# EAGLE design board (EAGLE 9.4.2)

## Sheet 1 of 8

## Sheet 2 of 8
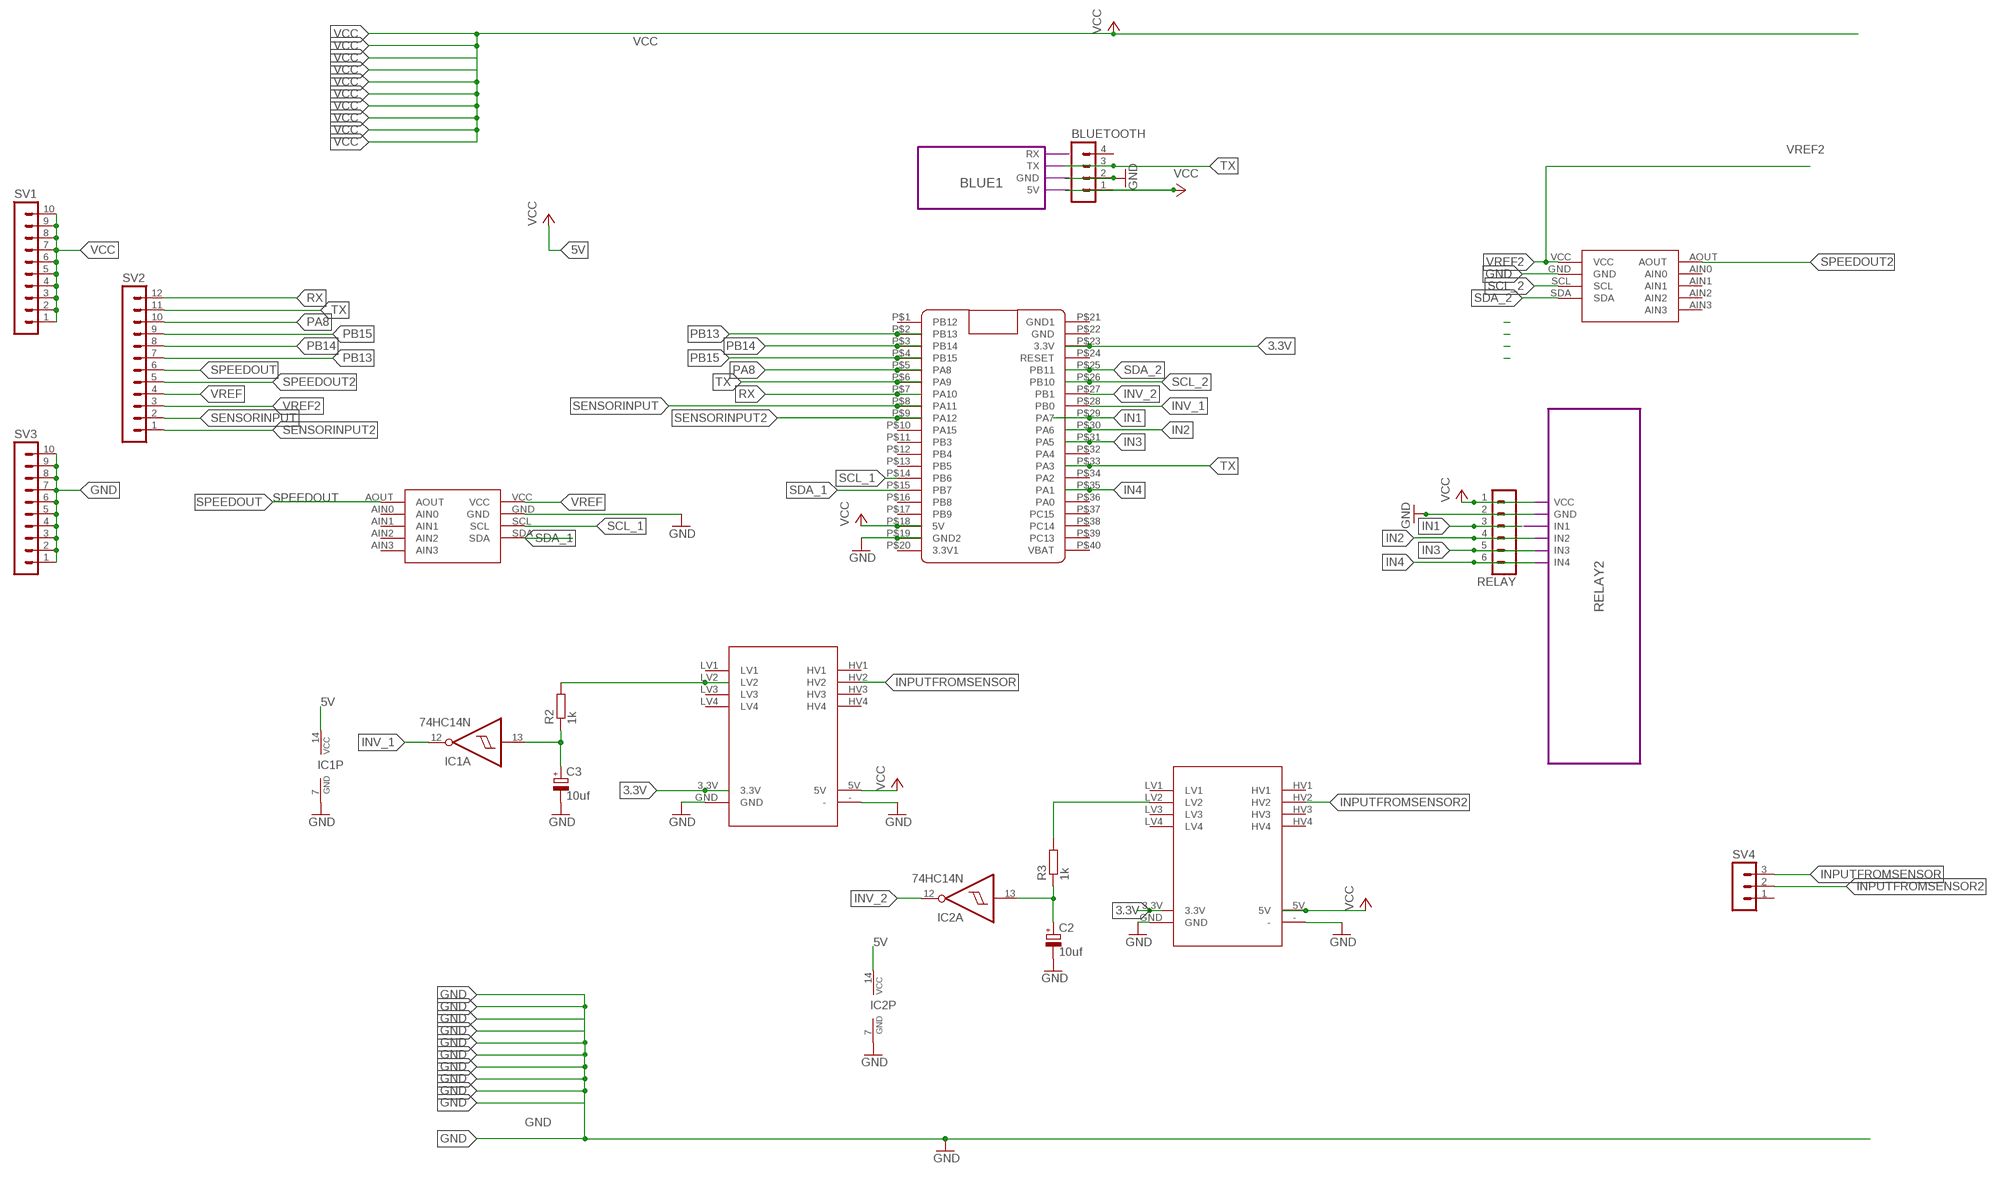
[diagram p0: schematic, sheet 2]

### Parts
BLUETOOTH  MA04-1  [MA04-1]
C2  10uf  CPOL-EUE3.5-8  [E3,5-8]
C3  10uf  CPOL-EUE3.5-8  [E3,5-8]
IC1  74HC14N  [DIL14]
IC2  74HC14N  [DIL14]
R2  1k  R-EU_0207/12  [0207/12]
R3  1k  R-EU_0207/12  [0207/12]
RELAY  MA06-1  [MA06-1]
SV1  MA10-1  [MA10-1]
SV2  MA12-1  [MA12-1]
SV3  MA10-1  [MA10-1]
SV4  MA03-1  [MA03-1]
U$1  SHIFT  [SHIFT]
U$2  SHIFT  [SHIFT]
U$3  BLUE_PILL  [BLUE_PILL]
U$5  DAC  [DAC]
U$6  DAC  [DAC]

### Module instances
RELAY2 = RELAY
BLUE1 = BLUE

### Nets
3.3V: U$1.3.3V U$2.3.3V U$3.P$23(3.3V)
5V: IC1.14(P:VCC) IC2.14(P:VCC) ; supply symbol labelled VCC
GND: BLUETOOTH.2 C2.- C3.- IC1.7(P:GND) IC2.7(P:GND) RELAY.2 SV3.1 SV3.2 SV3.3 SV3.4 SV3.5 SV3.6 SV3.7 SV3.8 SV3.9 SV3.10 U$1.- U$1.GND U$2.- U$2.GND U$3.P$19(GND2) U$5.GND U$6.GND
IN1: RELAY.3 U$3.P$29(PA7)
IN2: RELAY.4 U$3.P$30(PA6)
IN3: RELAY.5 U$3.P$31(PA5)
IN4: RELAY.6 U$3.P$35(PA1)
INPUTFROMSENSOR: SV4.3 U$2.HV2
INPUTFROMSENSOR2: SV4.2 U$1.HV2
INV_1: IC1.12(A:O) U$3.P$28(PB0)
INV_2: IC2.12(A:O) U$3.P$27(PB1)
N$5: R3.2 U$1.LV2
N$10: R2.2 U$2.LV2
N$14: C3.+ IC1.13(A:I) R2.1
N$21: C2.+ IC2.13(A:I) R3.1
PA8: SV2.10 U$3.P$5(PA8)
PB13: SV2.7 U$3.P$2(PB13)
PB14: SV2.8 U$3.P$3(PB14)
PB15: SV2.9 U$3.P$4(PB15)
RX: SV2.12 U$3.P$7(PA10)
SCL_1: U$3.P$14(PB6) U$5.SCL
SCL_2: U$3.P$26(PB10) U$6.SCL
SDA_1: U$3.P$15(PB7) U$5.SDA
SDA_2: U$3.P$25(PB11) U$6.SDA
SENSORINPUT: SV2.2 U$3.P$8(PA11)
SENSORINPUT2: SV2.1 U$3.P$9(PA12)
SPEEDOUT: SV2.6 U$5.AOUT
SPEEDOUT2: SV2.5 U$6.AOUT
TX: BLUETOOTH.3 SV2.11 U$3.P$6(PA9) U$3.P$33(PA3)
VCC: BLUETOOTH.1 RELAY.1 SV1.1 SV1.2 SV1.3 SV1.4 SV1.5 SV1.6 SV1.7 SV1.8 SV1.9 SV1.10 U$1.5V U$2.5V U$3.P$18(5V)
VREF: SV2.4 U$5.VCC
VREF2: SV2.3 U$6.VCC
Unconnected: BLUETOOTH.4 IC1.1(D:I) IC1.2(D:O) IC1.3(E:I) IC1.4(E:O) IC1.5(F:I) IC1.6(F:O) IC1.8(C:O) IC1.9(C:I) IC1.10(B:O) IC1.11(B:I) IC2.1(D:I) IC2.2(D:O) IC2.3(E:I) IC2.4(E:O) IC2.5(F:I) IC2.6(F:O) IC2.8(C:O) IC2.9(C:I) IC2.10(B:O) IC2.11(B:I) SV4.1 U$1.HV1 U$1.HV3 U$1.HV4 U$1.LV1 U$1.LV3 U$1.LV4 U$2.HV1 U$2.HV3 U$2.HV4 U$2.LV1 U$2.LV3 U$2.LV4 U$3.P$1(PB12) U$3.P$10(PA15) U$3.P$11(PB3) U$3.P$12(PB4) U$3.P$13(PB5) U$3.P$16(PB8) U$3.P$17(PB9) U$3.P$20(3.3V1) U$3.P$22(GND) U$3.P$24(RESET) U$3.P$32(PA4) U$3.P$34(PA2) U$3.P$36(PA0) U$3.P$37(PC15) U$3.P$38(PC14) U$3.P$39(PC13) U$3.P$40(VBAT) U$5.AIN0 U$5.AIN1 U$5.AIN2 U$5.AIN3 U$6.AIN0 U$6.AIN1 U$6.AIN2 U$6.AIN3

## Sheet 3 of 8

## Sheet 4 of 8

## Sheet 5 of 8
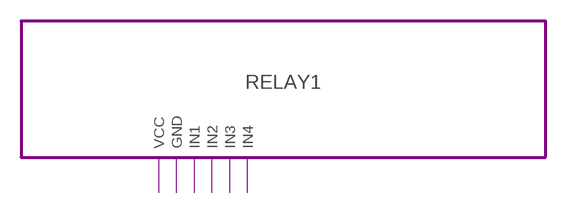
[diagram p1: schematic, sheet 5]

### Module instances
RELAY1 = RELAY

## Sheet 6 of 8
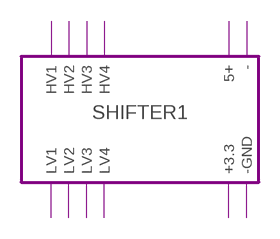
[diagram p2: schematic, sheet 6]

### Module instances
SHIFTER1 = SHIFTER

## Sheet 7 of 8
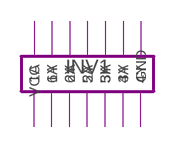
[diagram p3: schematic, sheet 7]

### Module instances
INV1 = INV

## Sheet 8 of 8
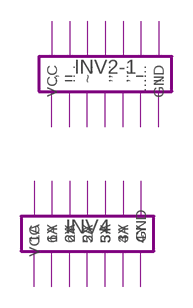
[diagram p4: schematic, sheet 8]

### Module instances
INV4 = INV
INV2-1 = INV2

## Power pins joined to a net without a drawn wire
GND1: U$3.P$21(GND1)

## Library data of the parts
BLUETOOTH = con-lstb:MA04-1: PIN HEADER; OC_FARNELL: unknown; OC_NEWARK: unknown
C2 C3 = rcl:CPOL-EU: POLARIZED CAPACITOR, European symbol; SPICEPREFIX: C
IC1 IC2 = 74xx-eu:74*14: Hex schmitt trigger INVERTER
R2 R3 = rcl:R-EU_: RESISTOR, European symbol; SPICEPREFIX: R
RELAY = con-lstb:MA06-1: PIN HEADER; OC_FARNELL: unknown; OC_NEWARK: unknown
SV1 SV3 = con-lstb:MA10-1: PIN HEADER; OC_FARNELL: unknown; OC_NEWARK: unknown
SV2 = con-lstb:MA12-1: PIN HEADER; OC_FARNELL: unknown; OC_NEWARK: unknown
SV4 = con-lstb:MA03-1: PIN HEADER; OC_FARNELL: unknown; OC_NEWARK: unknown
U$1 U$2 = shift:SHIFT
U$3 = BluePill:BLUE_PILL
U$5 U$6 = dac:DAC

## Module STM
Ports: PB12(io) PB13(io) PB14(io) PB15(io) PA8(io) PA9(io) PA10(io) PA11(io) PA12(io) PA15(io) PB(io) PB4(io) PB5(io) PB6(io) PB7(io) PB88(io) PB9(io) 5V(io) GND(io) VCC3.3(io) G(io) G2(io) 3.3V(io) R(io) B11(io) B10(io) B1(io) B0(io) A7(io) A6(io) A5(io) A4(io) A3(io) A2(io) A1(io) A0(io) C15(io) C14(io) C13(io) VB(io)

### Library data of the parts

## Module DAC
Ports: VCC(io) GND(io) SCL(io) SDA(io) AOUT(io) AINO(io) AIN1(io) AIN2(io) AIN(io)

### Library data of the parts

## Module BLUETOOTH
Ports: RXD(io) TXD(io) GND(io) VCC(io)

### Library data of the parts

## Module RELAY
Ports: VCC(io) GND(io) IN1(io) IN2(io) IN3(io) IN4(io)

### Library data of the parts

## Module SHIFTER
Ports: HV1(io) HV2(io) HV3(io) HV4(io) LV1(io) LV2(io) LV3(io) LV4(io) -(io) 5+(io) +3.3(io) -GND(io)

### Library data of the parts

## Module INV
Ports: VCC(io) 6A(io) 6Y(io) 5A(io) 5Y(io) 4A(io) 4Y(io) 1A(io) 1Y(io) 2A(io) 2Y(io) 3A(io) 3Y(io) GND(io)

### Library data of the parts

## Module INV2
Ports: VCC(io) .(io) ..(io) ...(io) ....(io) ......(io) GND(io) !(io) .!(io) ,(io) ,,(io) ~(io) !!(io) .,(io)

### Library data of the parts

## Module BLUE
Ports: 5V(io) GND(io) TX(io) RX(io)

### Library data of the parts

## Board
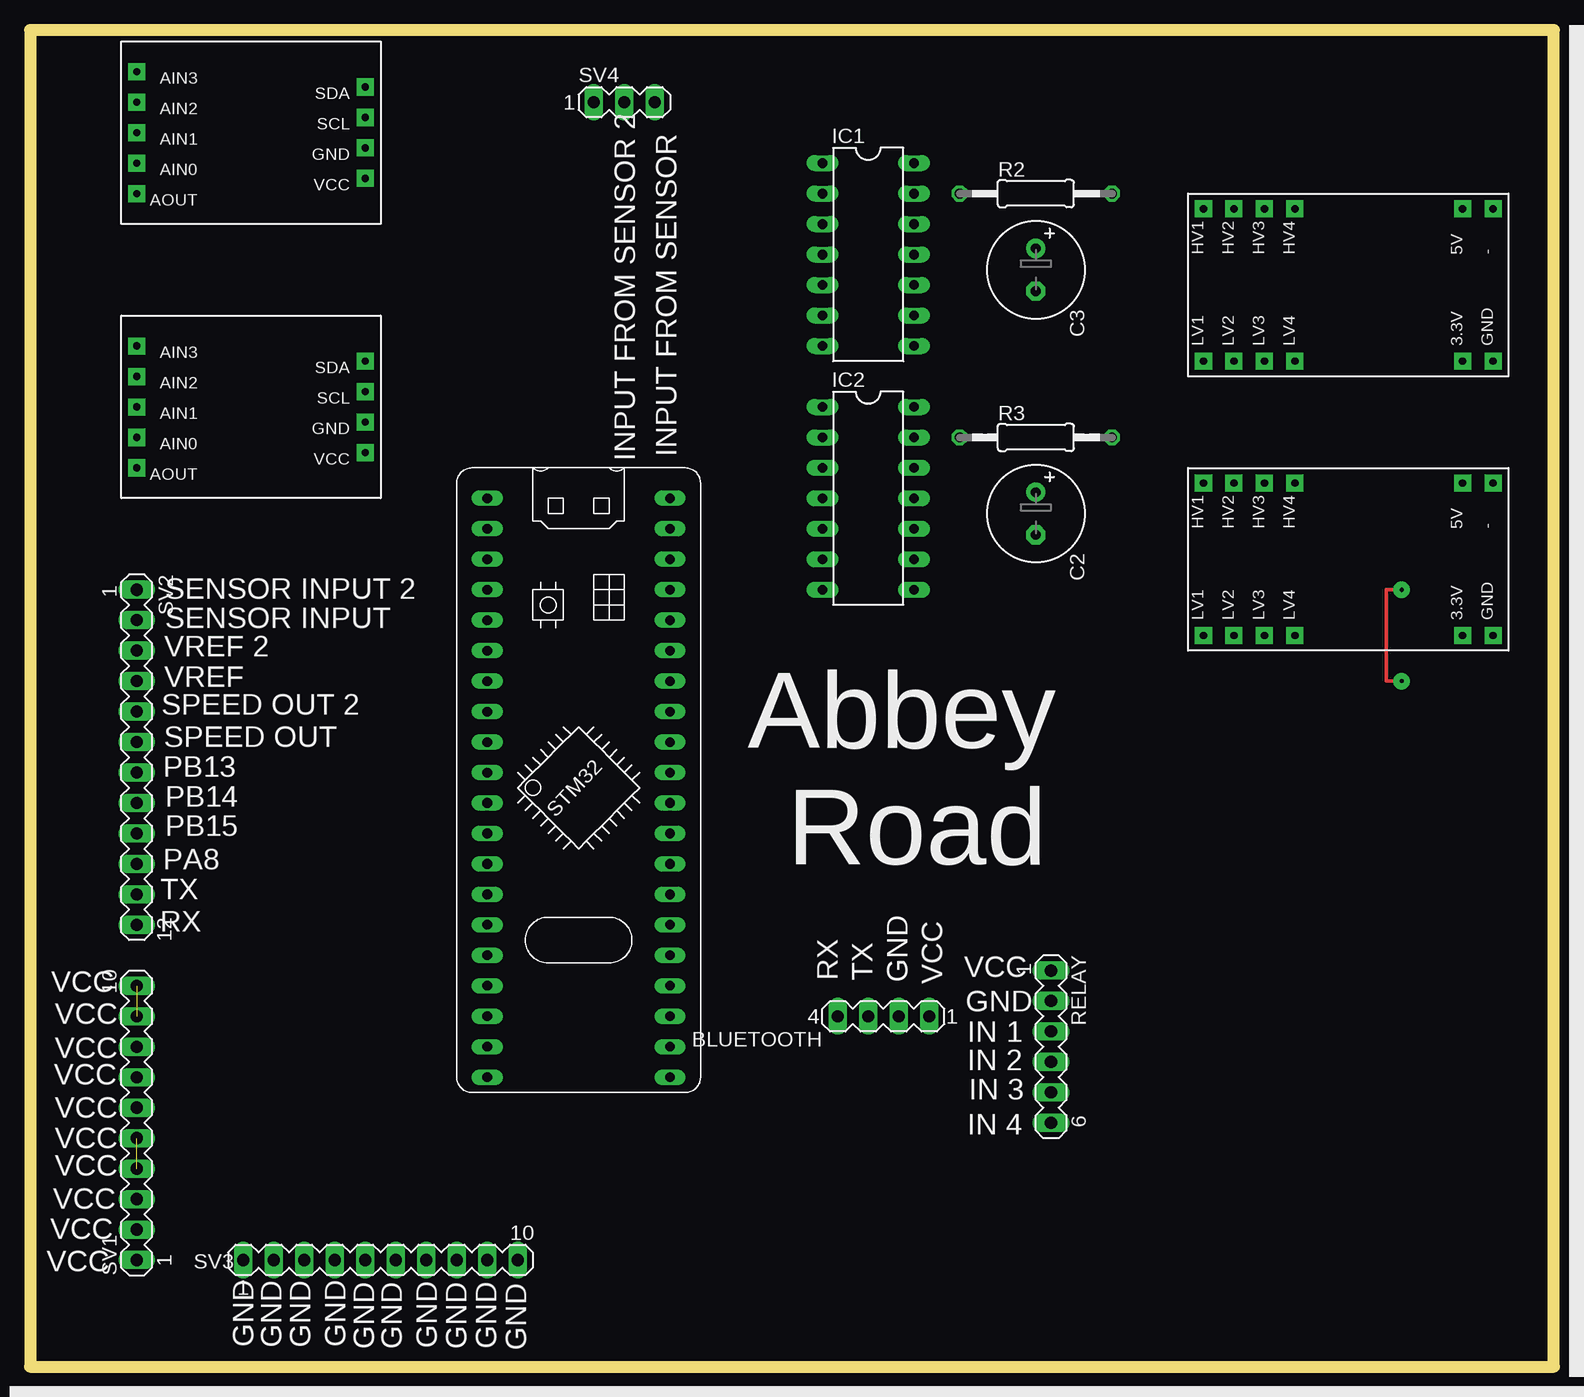
[diagram p5: board, top side]
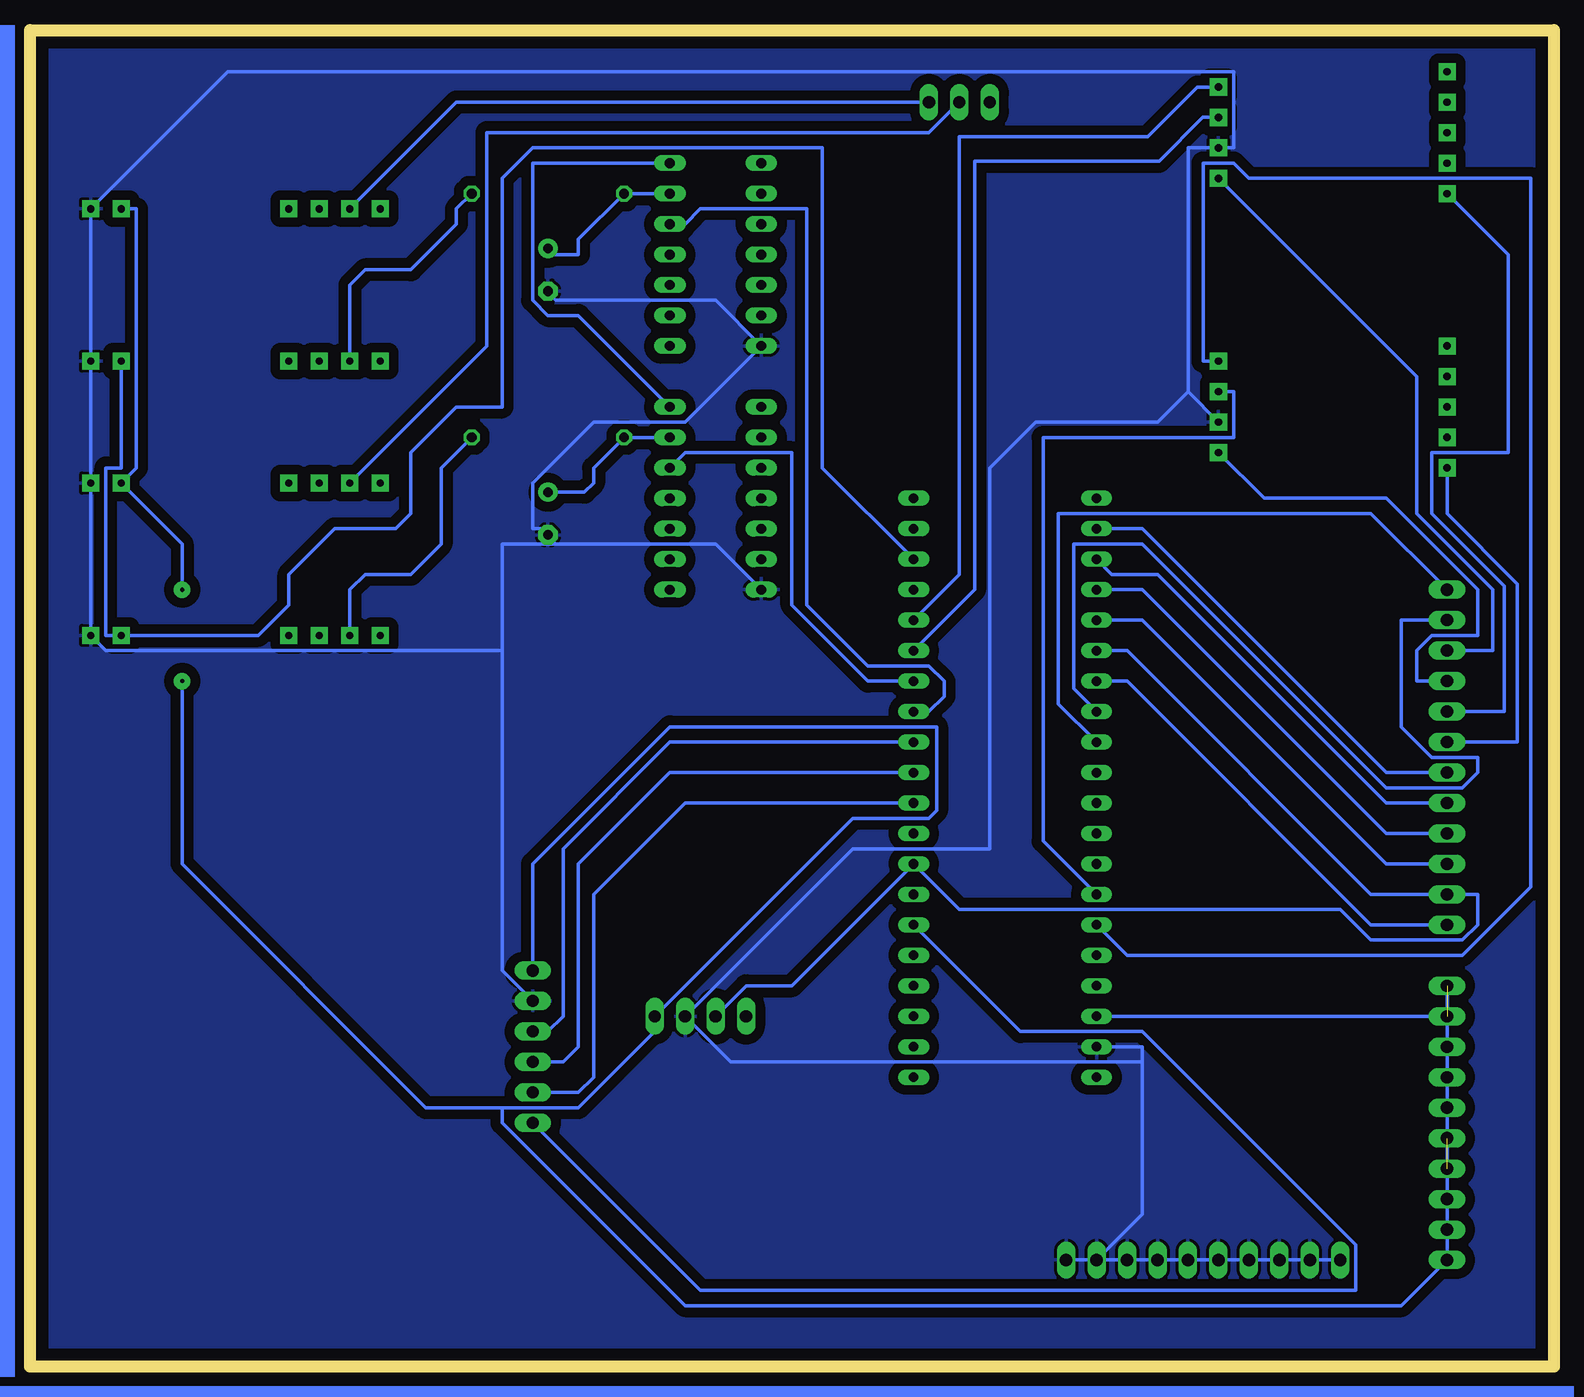
[diagram p6: board, bottom side, seen from below]

Size 126.98 x 111.43 mm. Coordinates in mm from the lower left corner, seen from the top.
Outline: 0,0 126.98,0 126.98,111.43 0,111.43 0,0
Copper layers (1*16): Top 0.035mm / dielectric 1.5mm / Bottom 0.035mm
Design rules "default *": minimum track width 12mil, minimum drill 0.35mm, track to track 18mil, track to pad 12mil, pad to pad 12mil, via to via 12mil, smd to smd 6mil, copper to edge 40mil, drill to drill 6mil, minimum pad ring 10mil, minimum via ring 20mil, stop-mask expansion 4mil, vias tented up to drill 0mil, thermal gap 10mil

### Footprints (pad centres in the part's own frame; a part is rotated, then mirrored left to right if it is on the bottom)
MA04-1 = drill 1.016 long: 1 -3.81,0; 2 -1.27,0; 3 1.27,0; 4 3.81,0
E3,5-8 = drill 0.813 pad 1.6: + -1.778,0 | drill 0.813 pad 1.6 octagon: - 1.778,0
DIL14 = drill 0.813 long: 1 -7.62,-3.81; 2 -5.08,-3.81; 3 -2.54,-3.81; 4 0,-3.81; 5 2.54,-3.81; 6 5.08,-3.81; 7 7.62,-3.81; 8 7.62,3.81; 9 5.08,3.81; 10 2.54,3.81; 11 0,3.81; 12 -2.54,3.81; 13 -5.08,3.81; 14 -7.62,3.81
0207/12 = drill 0.813 octagon: 1 -6.35,0; 2 6.35,0
MA06-1 = drill 1.016 long: 1 -6.35,0; 2 -3.81,0; 3 -1.27,0; 4 1.27,0; 5 3.81,0; 6 6.35,0
MA10-1 = drill 1.016 long: 1 -11.43,0; 2 -8.89,0; 3 -6.35,0; 4 -3.81,0; 5 -1.27,0; 6 1.27,0; 7 3.81,0; 8 6.35,0; 9 8.89,0; 10 11.43,0
MA12-1 = drill 1.016 long: 1 -13.97,0; 2 -11.43,0; 3 -8.89,0; 4 -6.35,0; 5 -3.81,0; 6 -1.27,0; 7 1.27,0; 8 3.81,0; 9 6.35,0; 10 8.89,0; 11 11.43,0; 12 13.97,0
MA03-1 = drill 1.016 long: 1 -2.54,0; 2 0,0; 3 2.54,0
SHIFT = drill 0.6 pad 1.422 square: 3.3V -7.62,-8.89; 5V 5.08,-8.89; - 5.08,-11.43; GND -7.62,-11.43; HV1 5.08,12.7; HV2 5.08,10.16; HV3 5.08,7.62; HV4 5.08,5.08; LV1 -7.62,12.7; LV2 -7.62,10.16; LV3 -7.62,7.62; LV4 -7.62,5.08
BLUE_PILL = drill 0.8 long: P$1 -7.62,15.24; P$2 -7.62,12.7; P$3 -7.62,10.16; P$4 -7.62,7.62; P$5 -7.62,5.08; P$6 -7.62,2.54; P$7 -7.62,0; P$8 -7.62,-2.54; P$9 -7.62,-5.08; P$10 -7.62,-7.62; P$11 -7.62,-10.16; P$12 -7.62,-12.7; P$13 -7.62,-15.24; P$14 -7.62,-17.78; P$15 -7.62,-20.32; P$16 -7.62,-22.86; P$17 -7.62,-25.4; P$18 -7.62,-27.94; P$19 -7.62,-30.48; P$20 -7.62,-33.02; P$21 7.62,15.24; P$22 7.62,12.7; P$23 7.62,10.16; P$24 7.62,7.62; P$25 7.62,5.08; P$26 7.62,2.54; P$27 7.62,0; P$28 7.62,-2.54; P$29 7.62,-5.08; P$30 7.62,-7.62; P$31 7.62,-10.16; P$32 7.62,-12.7; P$33 7.62,-15.24; P$34 7.62,-17.78; P$35 7.62,-20.32; P$36 7.62,-22.86; P$37 7.62,-25.4; P$38 7.62,-27.94; P$39 7.62,-30.48; P$40 7.62,-33.02
DAC = drill 0.6 pad 1.422 square: AIN0 11.43,2.54; AIN1 11.43,0; AIN2 11.43,-2.54; AIN3 11.43,-5.08; AOUT 11.43,5.08; GND -7.62,1.27; SCL -7.62,-1.27; SDA -7.62,-3.81; VCC -7.62,3.81

### Placement (x,y rotation side)
BLUETOOTH  71.12,29.21 180 top
C2  83.82,71.12 270 top
C3  83.82,91.44 270 top
IC1  69.85,92.71 270 top
IC2  69.85,72.39 270 top
R2  83.82,97.79 0 top
R3  83.82,77.47 0 top
RELAY  85.09,26.67 270 top
SV1  8.89,20.32 90 top
SV2  8.89,50.8 270 top
SV3  29.21,8.89 0 top
SV4  49.53,105.41 0 top
U$1  110.49,68.58 90 top
U$2  110.49,91.44 90 top
U$3  45.72,57.15 0 top
U$5  20.32,80.01 180 top
U$6  20.32,102.87 180 top

### Tracks (layer width: path | path; a pad name or v marks a point on that pad's centre or on a via)
3.3V
  Bottom 0.305: U$3.P$23 60.96,74.93 60.96,101.6 85.09,101.6 87.63,99.06 87.63,80.01 91.44,80.01 95.25,76.2 95.25,71.12 96.52,69.85 101.6,69.85 105.41,66.04 105.41,63.5 107.95,60.96 U$1.3.3V 120.65,60.96 120.65,74.93 119.38,74.93 U$2.3.3V
5V
  Bottom 0.305: IC2.14 81.28,87.63 83.82,87.63 85.09,88.9 85.09,100.33 IC1.14
GND
  Bottom 0.305: SV3.1 SV3.10 | SV3.9 34.29,12.7 34.29,25.4 | U$3.P$19 34.29,26.67 34.29,25.4 | C3.- 83.82,89.54 83.18,88.9 69.85,88.9 IC1.7 72.39,78.74 80.01,78.74 85.09,73.66 85.09,69.85 83.82,69.85 C2.- 83.82,69.22 83.18,68.58 | IC2.7 69.85,68.58 83.18,68.58 | RELAY.2 87.63,33.02 87.63,59.69 | 87.63,59.69 87.63,68.58 83.18,68.58 | 87.63,59.69 120.65,59.69 U$1.GND U$1.- U$2.GND U$2.- 110.49,107.95 26.67,107.95 26.67,101.6 U$6.GND 30.48,101.6 30.48,81.28 | 30.48,81.28 U$5.GND | 34.29,25.4 68.58,25.4 BLUETOOTH.2 58.42,43.18 46.99,43.18 46.99,74.93 43.18,78.74 33.02,78.74 30.48,81.28
  pour Bottom (isolate 0.813): 0,110.49 127,110.49 127,0 0,0
IN1
  Bottom 0.305: U$3.P$29 73.66,52.07 82.55,43.18 82.55,29.21 83.82,27.94 RELAY.3
IN2
  Bottom 0.305: RELAY.4 82.55,25.4 81.28,26.67 81.28,41.91 73.66,49.53 U$3.P$30
IN3
  Bottom 0.305: U$3.P$31 72.39,46.99 80.01,39.37 80.01,24.13 81.28,22.86 RELAY.5
IN4
  Bottom 0.305: U$3.P$35 44.45,27.94 34.29,27.94 16.51,10.16 16.51,6.35 71.12,6.35 RELAY.6
INPUTFROMSENSOR
  Bottom 0.305: U$2.HV2 91.44,105.41 SV4.3
INPUTFROMSENSOR2
  Bottom 0.305: U$1.HV2 88.9,85.09 88.9,102.87 52.07,102.87 SV4.2
INV_1
  Bottom 0.305: U$3.P$28 52.07,54.61 50.8,55.88 50.8,57.15 52.07,58.42 57.15,58.42 62.23,63.5 62.23,96.52 71.12,96.52 72.39,95.25 IC1.12
INV_2
  Bottom 0.305: U$3.P$27 57.15,57.15 63.5,63.5 63.5,76.2 72.39,76.2 IC2.12
N$5
  Bottom 0.305: R3.2 92.71,74.93 92.71,68.58 95.25,66.04 99.06,66.04 100.33,64.77 U$1.LV2
N$10
  Bottom 0.305: R2.2 91.44,96.52 91.44,95.25 95.25,91.44 99.06,91.44 100.33,90.17 U$2.LV2
N$14
  Bottom 0.305: IC1.13 R2.1 81.28,93.98 81.28,92.71 83.31,92.71 C3.+
N$21
  Bottom 0.305: IC2.13 R3.1 80.01,74.93 80.01,73.66 80.77,72.9 C2.+
PA8
  Bottom 0.305: U$3.P$5 34.29,62.23 13.97,41.91 SV2.10
PB13
  Bottom 0.305: SV2.7 13.97,49.53 34.29,69.85 U$3.P$2
PB14
  Bottom 0.305: U$3.P$3 36.83,66.04 33.02,66.04 13.97,46.99 SV2.8
PB15
  Bottom 0.305: SV2.9 13.97,44.45 34.29,64.77 U$3.P$4
RX
  Bottom 0.305: U$3.P$7 35.56,57.15 15.24,36.83 SV2.12
SCL_1
  Bottom 0.305: U$3.P$14 42.54,43.82 42.54,77.47 26.67,77.47 26.67,81.28 U$5.SCL
SCL_2
  Bottom 0.305: U$3.P$26 48.26,64.77 48.26,100.48 32.89,100.48 29.24,104.14 U$6.SCL
SDA_1
  Bottom 0.305: U$3.P$15 35.56,34.29 7.62,34.29 1.93,39.98 1.93,99.06 25.4,99.06 26.67,100.33 29.21,100.33 29.21,83.82 U$5.SDA
SDA_2
  Bottom 0.305: U$3.P$25 49.53,66.04 49.53,102.54 33.83,102.54 29.69,106.68 U$6.SDA
SENSORINPUT
  Bottom 0.305: U$3.P$8 40,56.52 40,68.58 34.29,68.58 13.97,48.26 7.62,48.26 6.35,49.53 6.35,50.8 10.16,50.8 12.7,53.34 12.7,62.23 SV2.2
SENSORINPUT2
  Bottom 0.305: U$3.P$9 41.27,55.25 41.27,71.12 15.24,71.12 SV2.1
SPEEDOUT
  Bottom 0.305: U$5.AOUT 8.89,71.12 3.02,65.25 3.02,52.07 SV2.6
SPEEDOUT2
  Bottom 0.305: U$6.AOUT 3.81,92.71 3.81,76.2 10.16,76.2 10.16,71.12 4.11,65.08 4.11,54.61 SV2.5
TX
  Bottom 0.305: U$3.P$6 35.56,59.69 15.24,39.37 SV2.11 6.35,39.37 6.35,36.83 7.62,35.56 15.24,35.56 17.78,38.1 49.53,38.1 U$3.P$33 63.5,31.75 67.31,31.75 BLUETOOTH.3
VCC  (via drill 0.35)  (2 unrouted)
  Top 0.305: v114.3,64.77 113.03,64.77 113.03,57.15 v114.3,57.15
  Bottom 0.305: SV1.10 SV1.8 SV1.6 | SV1.9 U$3.P$18 | RELAY.1 85.09,41.91 73.66,53.34 51.43,53.34 51.43,46.36 52.07,45.72 58.42,45.72 BLUETOOTH.1 74.93,27.94 81.28,21.59 87.63,21.59 | 87.63,21.59 87.63,20.32 72.39,5.08 12.7,5.08 SV1.1 SV1.2 SV1.3 SV1.5 SV1.6 | U$2.5V 118.11,96.52 118.11,74.93 U$1.5V 114.3,68.58 v114.3,64.77 | 87.63,21.59 93.98,21.59 114.3,41.91 v114.3,57.15 | SV1.7 SV1.6
VREF
  Bottom 0.305: U$5.VCC 24.13,72.39 13.97,72.39 6.35,64.77 6.35,60.96 10.16,60.96 11.43,59.69 11.43,57.15 SV2.4
VREF2
  Bottom 0.305: U$6.VCC 11.43,82.55 11.43,71.12 5.08,64.77 5.08,59.69 SV2.3
(copper drawn outside any net)
  shapes: Bottom area x2

### Text on the board
tNames: INPUT FROM SENSOR | INPUT FROM SENSOR 2 | SENSOR INPUT 2 | SENSOR INPUT | VREF 2 | VREF | SPEED OUT 2 | SPEED OUT | Abbey / Road | PB13 | PB14 | PB15 | PA8 | TX | RX | RX | TX | GND | VCC | VCC | VCC | GND | VCC | IN 1 | VCC | IN 2 | VCC | IN 3 | VCC | IN 4 | VCC | VCC | VCC | VCC | VCC | GND | GND | GND | GND | GND | GND | GND | GND | GND | GND